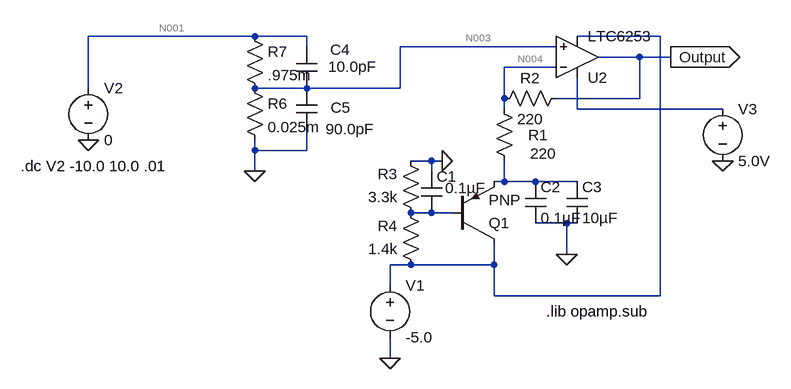
[diagram p0: schematic OPAMP-0.6Vp-p-bitscope.asc]
* OPAMP-0.6Vp-p-bitscope.asc
V2 N001 0 0
R1 N004 N006 220
R3 N007 0 3.3k
R4 N002 N007 1.4k
Q1 N002 N007 N006 0 PNP
V1 N002 0 -5.0
R2 Output N004 220
C1 0 N007 0.1µF
C2 N006 0 0.1µF
C3 N006 0 10µF
* U2: LTC6253 (symbol Opamps\LTC6253 not available, pins judged from their places): In+=N003 In-=N004 V+=N005 V-=N002 OUT=Output
V3 N005 0 5.0V
R6 N003 0 0.025m
R7 N001 N003 .975m
C4 N001 N003 10.0pF
C5 N003 0 90.0pF
.model NPN NPN
.model PNP PNP
.lib standard.bjt
.dc V2 -10.0 10.0 .01
.lib opamp.sub
.backanno
.end

* Results of the author's LTspice run, read from the files saved beside the schematic
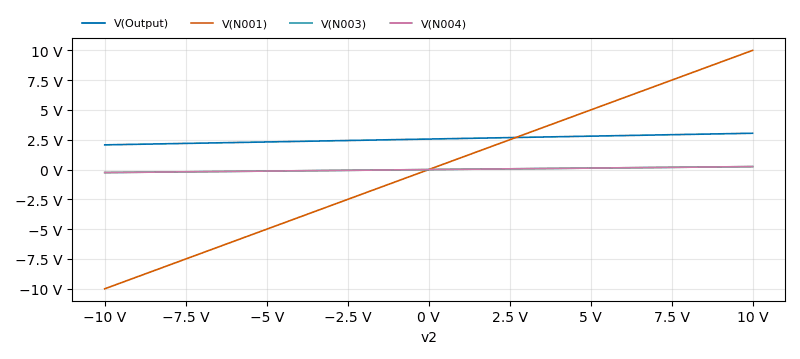
[diagram p1: DC transfer characteristic of OPAMP-0.6Vp-p-bitscope.asc, plotted from the saved traces]
* DC transfer characteristic, 1 run:
*   V(Output): 2.074 V at v2=-10 V, 3.048 V at v2=10 V, min 2.074 V, max 3.048 V
*   V(N001): -10 V at v2=-10 V, 10 V at v2=10 V, min -10 V, max 10 V
*   V(N003): -250 mV at v2=-10 V, 250 mV at v2=10 V, min -250 mV, max 250 mV
*   V(N004): -249.7 mV at v2=-10 V, 250.2 mV at v2=10 V, min -249.7 mV, max 250.2 mV